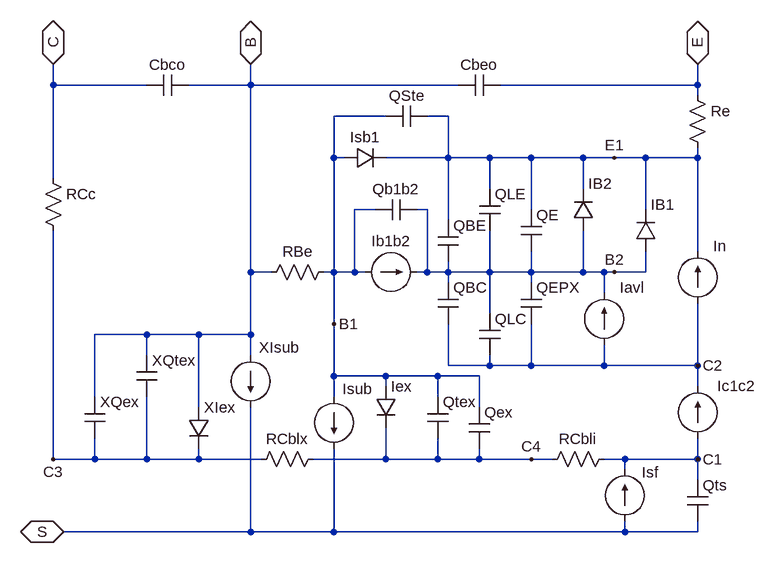
[diagram p0: schematic builtin_02_mextram.asc]
builtin_02_mextram.asc, the LTspice schematic file:
Version 4
SHEET 1 880 828
WIRE -672 -48 -672 -80
WIRE -528 -48 -672 -48
WIRE -368 -48 -368 -80
WIRE -368 -48 -464 -48
WIRE -48 -48 -368 -48
WIRE 320 -48 320 -80
WIRE 320 -48 16 -48
WIRE 320 -32 320 -48
WIRE -160 0 -240 0
WIRE -64 0 -96 0
WIRE -240 64 -240 0
WIRE -224 64 -240 64
WIRE -64 64 -64 0
WIRE -64 64 -160 64
WIRE 0 64 -64 64
WIRE 64 64 0 64
WIRE 144 64 64 64
WIRE 192 64 144 64
WIRE 240 64 192 64
WIRE 320 64 320 48
WIRE 320 64 240 64
WIRE -672 96 -672 -48
WIRE 0 112 0 64
WIRE 144 112 144 64
WIRE -176 144 -208 144
WIRE -96 144 -112 144
WIRE 64 144 64 64
WIRE 240 144 240 64
WIRE -64 160 -64 64
WIRE 320 208 320 64
WIRE -368 240 -368 -48
WIRE -336 240 -368 240
WIRE -240 240 -240 64
WIRE -240 240 -256 240
WIRE -208 240 -208 144
WIRE -208 240 -240 240
WIRE -192 240 -208 240
WIRE -96 240 -96 144
WIRE -96 240 -112 240
WIRE -64 240 -64 224
WIRE -64 240 -96 240
WIRE 0 240 0 176
WIRE 0 240 -64 240
WIRE 64 240 64 208
WIRE 64 240 0 240
WIRE 144 240 144 176
WIRE 144 240 64 240
WIRE 176 240 144 240
WIRE 192 240 176 240
WIRE 240 240 240 208
WIRE 240 240 192 240
WIRE -64 256 -64 240
WIRE 64 256 64 240
WIRE 176 272 176 240
WIRE 0 304 0 240
WIRE -240 320 -240 240
WIRE -528 336 -608 336
WIRE -448 336 -528 336
WIRE -368 336 -368 240
WIRE -368 336 -448 336
WIRE -528 368 -528 336
WIRE -368 368 -368 336
WIRE -64 384 -64 320
WIRE 0 384 0 368
WIRE 0 384 -64 384
WIRE 64 384 64 320
WIRE 64 384 0 384
WIRE 176 384 176 352
WIRE 176 384 64 384
WIRE 320 384 320 288
WIRE 320 384 176 384
WIRE -240 400 -240 320
WIRE -160 400 -240 400
WIRE -80 400 -160 400
WIRE -16 400 -80 400
WIRE -160 416 -160 400
WIRE 320 416 320 384
WIRE -608 432 -608 336
WIRE -240 432 -240 400
WIRE -80 432 -80 400
WIRE -448 448 -448 336
WIRE -16 448 -16 400
WIRE -672 528 -672 176
WIRE -608 528 -608 496
WIRE -608 528 -672 528
WIRE -528 528 -528 432
WIRE -528 528 -608 528
WIRE -448 528 -448 512
WIRE -448 528 -528 528
WIRE -352 528 -448 528
WIRE -160 528 -160 480
WIRE -160 528 -272 528
WIRE -80 528 -80 496
WIRE -80 528 -160 528
WIRE -16 528 -16 512
WIRE -16 528 -80 528
WIRE 64 528 -16 528
WIRE 96 528 64 528
WIRE 208 528 176 528
WIRE 320 528 320 496
WIRE 320 528 208 528
WIRE 208 544 208 528
WIRE 320 560 320 528
WIRE -368 640 -368 448
WIRE -368 640 -656 640
WIRE -240 640 -240 512
WIRE -240 640 -368 640
WIRE 208 640 208 624
WIRE 208 640 -240 640
WIRE 320 640 320 624
WIRE 320 640 208 640
FLAG 320 -80 E
IOPIN 320 -80 BiDir
FLAG -368 -80 B
IOPIN -368 -80 BiDir
FLAG -672 -80 C
IOPIN -672 -80 BiDir
FLAG 192 64 E1
FLAG 192 240 B2
FLAG 320 384 C2
FLAG -240 320 B1
FLAG 320 528 C1
FLAG 64 528 C4
FLAG -656 640 S
IOPIN -656 640 BiDir
FLAG -672 528 C3
SYMBOL current 320 288 M180
WINDOW 0 24 88 Left 0
WINDOW 3 24 0 Left 0
SYMATTR InstName In
SYMATTR Value ""
SYMBOL res 304 -48 R0
SYMATTR InstName Re
SYMATTR Value ""
SYMBOL diode 224 208 M180
WINDOW 0 24 72 Left 0
WINDOW 3 24 0 Left 0
SYMATTR InstName IB1
SYMATTR Value ""
SYMBOL diode 128 176 M180
WINDOW 0 24 72 Left 0
WINDOW 3 24 0 Left 0
SYMATTR InstName IB2
SYMATTR Value ""
SYMBOL current 176 352 M180
WINDOW 0 24 88 Left 0
WINDOW 3 24 0 Left 0
SYMATTR InstName Iavl
SYMATTR Value ""
SYMBOL cap -16 112 R0
SYMATTR InstName QLE
SYMATTR Value ""
SYMBOL cap -80 160 R0
SYMATTR InstName QBE
SYMATTR Value ""
SYMBOL cap -80 256 R0
SYMATTR InstName QBC
SYMATTR Value ""
SYMBOL cap -16 304 R0
SYMATTR InstName QLC
SYMATTR Value ""
SYMBOL cap 48 256 R0
SYMATTR InstName QEPX
SYMATTR Value ""
SYMBOL cap 48 144 R0
SYMATTR InstName QE
SYMATTR Value ""
SYMBOL current 320 496 M180
WINDOW 0 30 81 Left 0
WINDOW 3 24 0 Left 0
SYMATTR InstName Ic1c2
SYMATTR Value ""
SYMBOL cap 16 -64 R90
WINDOW 0 0 32 VBottom 0
WINDOW 3 32 32 VTop 0
SYMATTR InstName Cbeo
SYMATTR Value ""
SYMBOL cap -464 -64 R90
WINDOW 0 0 32 VBottom 0
WINDOW 3 32 32 VTop 0
SYMATTR InstName Cbco
SYMATTR Value ""
SYMBOL current -192 240 M90
WINDOW 0 -32 40 VBottom 0
WINDOW 3 32 40 VTop 0
SYMATTR InstName Ib1b2
SYMATTR Value ""
SYMBOL cap -96 -16 R90
WINDOW 0 0 32 VBottom 0
WINDOW 3 32 32 VTop 0
SYMATTR InstName QSte
SYMATTR Value ""
SYMBOL cap -112 128 R90
WINDOW 0 0 32 VBottom 0
WINDOW 3 32 32 VTop 0
SYMATTR InstName Qb1b2
SYMATTR Value ""
SYMBOL diode -224 48 M90
WINDOW 0 0 32 VBottom 0
WINDOW 3 32 32 VTop 0
SYMATTR InstName Isb1
SYMATTR Value ""
SYMBOL diode -176 416 R0
SYMATTR InstName Iex
SYMATTR Value ""
SYMBOL current -240 432 R0
WINDOW 0 13 -12 Left 0
SYMATTR InstName Isub
SYMATTR Value ""
SYMBOL cap -96 432 R0
SYMATTR InstName Qtex
SYMATTR Value ""
SYMBOL cap -32 448 R0
SYMATTR InstName Qex
SYMATTR Value ""
SYMBOL res 192 512 R90
WINDOW 0 0 56 VBottom 0
WINDOW 3 32 56 VTop 0
SYMATTR InstName RCbli
SYMATTR Value ""
SYMBOL res -256 512 R90
WINDOW 0 0 56 VBottom 0
WINDOW 3 32 56 VTop 0
SYMATTR InstName RCblx
SYMATTR Value ""
SYMBOL res -240 224 R90
WINDOW 0 0 56 VBottom 0
WINDOW 3 32 56 VTop 0
SYMATTR InstName RBe
SYMATTR Value ""
SYMBOL current 208 624 M180
WINDOW 0 26 76 Left 0
WINDOW 3 24 0 Left 0
SYMATTR InstName Isf
SYMATTR Value ""
SYMBOL cap 304 560 R0
SYMATTR InstName Qts
SYMATTR Value ""
SYMBOL current -368 368 R0
WINDOW 0 13 -12 Left 0
SYMATTR InstName XIsub
SYMATTR Value ""
SYMBOL cap -624 432 R0
SYMATTR InstName XQex
SYMATTR Value ""
SYMBOL cap -544 368 R0
SYMATTR InstName XQtex
SYMATTR Value ""
SYMBOL diode -464 448 R0
SYMATTR InstName XIex
SYMATTR Value ""
SYMBOL res -688 80 R0
SYMATTR InstName RCc
SYMATTR Value ""

The netlist it stands for:
* builtin_02_mextram.asc
In C2 E1
Re E E1
D§IB1 B2 E1
D§IB2 B2 E1
Iavl C2 B2
C§QLE E1 B2
C§QBE E1 B2
C§QBC B2 C2
C§QLC B2 C2
C§QEPX B2 C2
C§QE E1 B2
Ic1c2 C1 C2
Cbeo E B
Cbco B C
Ib1b2 B1 B2
C§QSte E1 B1
C§Qb1b2 B2 B1
D§Isb1 B1 E1
D§Iex B1 C4
Isub B1 S
C§Qtex B1 C4
C§Qex B1 C4
RCbli C1 C4
RCblx C4 C3
RBe B1 B
Isf S C1
C§Qts C1 S
I§XIsub B S
C§XQex B C3
C§XQtex B C3
D§XIex B C3
RCc C C3
.model D D
.lib standard.dio
.backanno
.end